# Altium project XTXBoard.PrjPCB
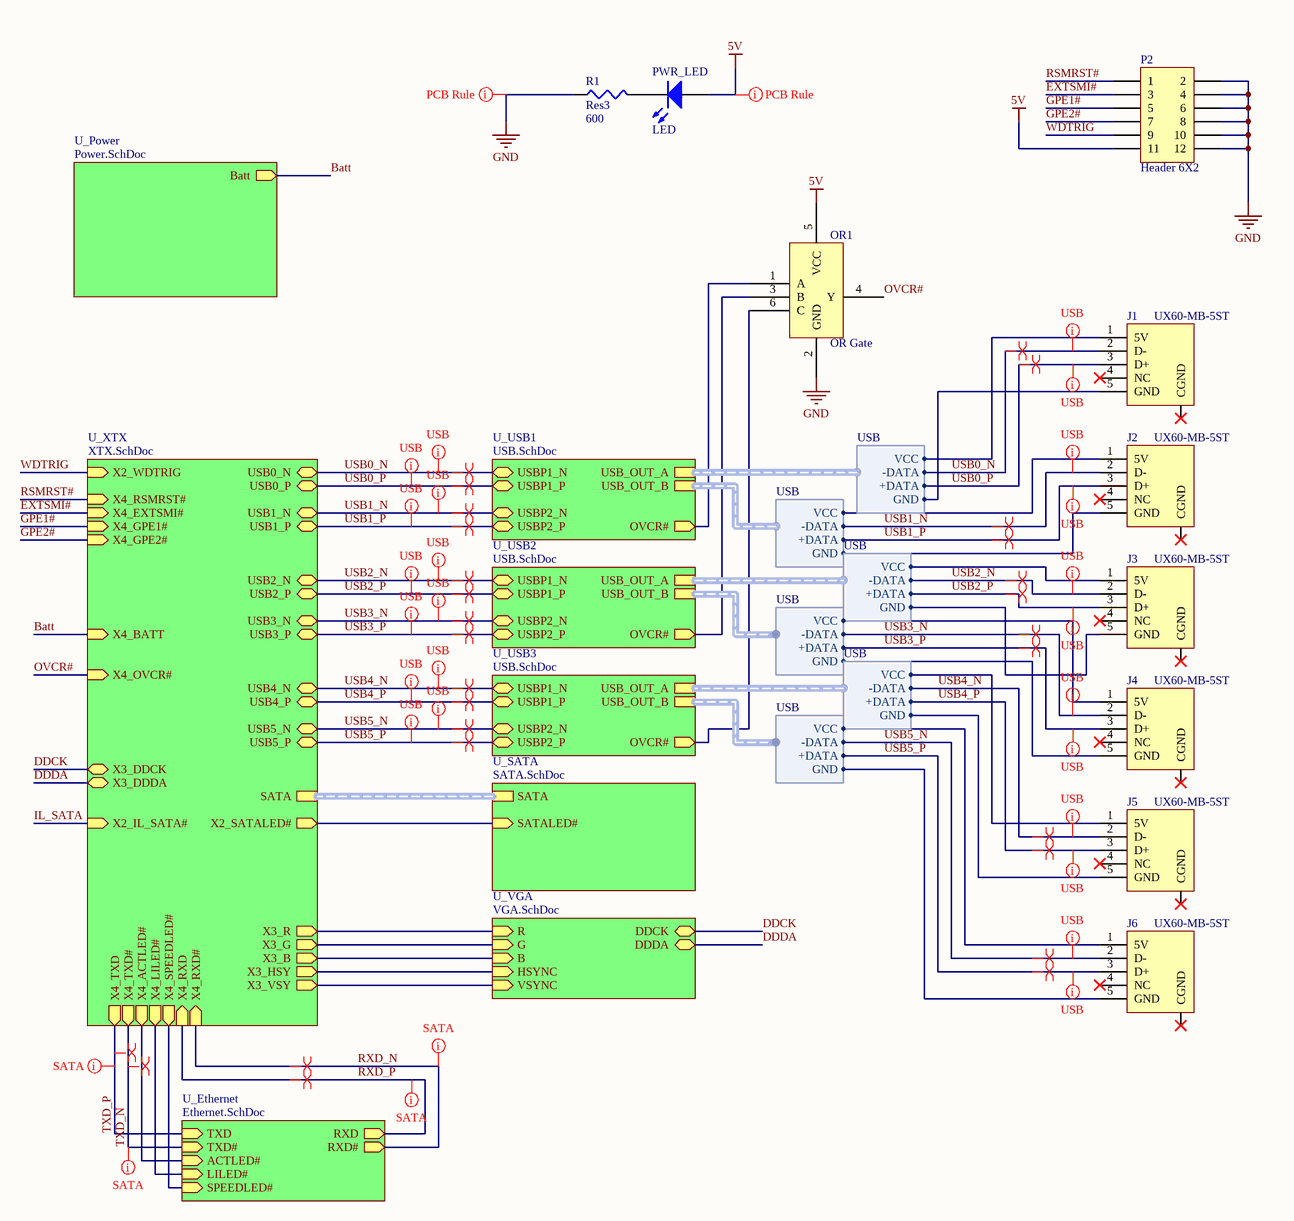
[diagram p0: Carrier_Board.SchDoc]
7 sheets, 110 parts. Net scope: hierarchical (ports join the sheet entries above them; power ports are global).
Board file: Carrier_Board.PcbDoc
Sheets:
  Carrier_Board.SchDoc
    U_USB1 = USB.SchDoc
    U_USB2 = USB.SchDoc
    U_USB3 = USB.SchDoc
    U_Ethernet = Ethernet.SchDoc
    U_SATA = SATA.SchDoc
    U_VGA = VGA.SchDoc
    U_XTX = XTX.SchDoc
    U_Power = Power.SchDoc

## Sheet Carrier_Board.SchDoc
size B

### Parts
J1  UX60-MB-5ST  [UX60-MB-5ST]
J2  UX60-MB-5ST  [UX60-MB-5ST]
J3  UX60-MB-5ST  [UX60-MB-5ST]
J4  UX60-MB-5ST  [UX60-MB-5ST]
J5  UX60-MB-5ST  [UX60-MB-5ST]
J6  UX60-MB-5ST  [UX60-MB-5ST]
OR1  OR Gate  [TSOP65P210X110-6N]
P2  Header 6X2  [HDR2X6]
PWR_LED  LED  [0805]
R1  Res3  value 600  [J1-0603]

### Sub-sheets
U_Ethernet = Ethernet.SchDoc: TXD (in), TXD# (in), RXD (out), RXD# (out), ACTLED# (in), LILED# (in), SPEEDLED# (in)
U_Power = Power.SchDoc: Batt (out)
U_SATA = SATA.SchDoc: SATA (harness SATA), SATALED# (in)
U_USB1 = USB.SchDoc: USB_OUT_A (harness USB), USB_OUT_B (harness USB), OVCR# (out), USBP1_N (bidir), USBP1_P (bidir), USBP2_N (bidir), USBP2_P (bidir)
U_USB2 = USB.SchDoc: USB_OUT_A (harness USB), USB_OUT_B (harness USB), OVCR# (out), USBP1_N (bidir), USBP1_P (bidir), USBP2_N (bidir), USBP2_P (bidir)
U_USB3 = USB.SchDoc: USB_OUT_A (harness USB), USB_OUT_B (harness USB), OVCR# (out), USBP1_N (bidir), USBP1_P (bidir), USBP2_N (bidir), USBP2_P (bidir)
U_VGA = VGA.SchDoc: R (in), G (in), B (in), HSYNC (in), VSYNC (in), DDCK (bidir), DDDA (bidir)
U_XTX = XTX.SchDoc: X4_OVCR# (in), SATA (harness SATA), X2_IL_SATA# (in), X2_SATALED# (out), X3_R (out), X3_HSY (out), X3_VSY (out), X3_DDCK (bidir), X3_DDDA (bidir), X4_BATT (in), X4_LILED# (out), X4_ACTLED# (out), X4_SPEEDLED# (out), X4_RXD# (in), X4_RXD (in), X4_TXD# (out), X4_TXD (out), X3_B (out), X3_G (out), X2_WDTRIG (in), X4_RSMRST# (in), X4_EXTSMI# (in), X4_GPE2# (in), X4_GPE1# (in), USB2_N (bidir), USB3_N (bidir), USB2_P (bidir), USB3_P (bidir), USB0_N (bidir), USB0_P (bidir), USB1_P (bidir), USB1_N (bidir), USB5_N (bidir), USB4_P (bidir), USB4_N (bidir), USB5_P (bidir)

### Harnesses
USB: VCC, -DATA, +DATA, GND

### Nets
5V: OR1.5(VCC) P2.11 PWR_LED.1(A)
GND: OR1.2(GND) P2.2 P2.4 P2.6 P2.8 P2.10 P2.12 R1.1
Batt: sheet U_XTX/X4_BATT, sheet U_Power/Batt
DDCK: sheet U_VGA/DDCK, sheet U_XTX/X3_DDCK
DDDA: sheet U_VGA/DDDA, sheet U_XTX/X3_DDDA
EXTSMI#: P2.3 ; sheet U_XTX/X4_EXTSMI#
GPE1#: P2.5 ; sheet U_XTX/X4_GPE1#
GPE2#: P2.7 ; sheet U_XTX/X4_GPE2#
OVCR#: OR1.4(Y) ; sheet U_XTX/X4_OVCR#
RSMRST#: P2.1 ; sheet U_XTX/X4_RSMRST#
RXD_N: sheet U_Ethernet/RXD#, sheet U_XTX/X4_RXD#
RXD_P: sheet U_Ethernet/RXD, sheet U_XTX/X4_RXD
TXD_N: sheet U_Ethernet/TXD#, sheet U_XTX/X4_TXD#
TXD_P: sheet U_Ethernet/TXD, sheet U_XTX/X4_TXD
USB0_N: J1.2(D-) ; sheet U_USB1/USBP1_N, sheet U_XTX/USB0_N, sheet U_USB1/USB_OUT_A.-DATA
USB0_P: J1.3(D+) ; sheet U_USB1/USBP1_P, sheet U_XTX/USB0_P, sheet U_USB1/USB_OUT_A.+DATA
USB1_N: J2.2(D-) ; sheet U_USB1/USBP2_N, sheet U_XTX/USB1_N, sheet U_USB1/USB_OUT_B.-DATA
USB1_P: J2.3(D+) ; sheet U_USB1/USBP2_P, sheet U_XTX/USB1_P, sheet U_USB1/USB_OUT_B.+DATA
USB2_N: J3.2(D-) ; sheet U_USB2/USBP1_N, sheet U_XTX/USB2_N, sheet U_USB2/USB_OUT_A.-DATA
USB2_P: J3.3(D+) ; sheet U_USB2/USBP1_P, sheet U_XTX/USB2_P, sheet U_USB2/USB_OUT_A.+DATA
USB3_N: J4.2(D-) ; sheet U_USB2/USBP2_N, sheet U_XTX/USB3_N, sheet U_USB2/USB_OUT_B.-DATA
USB3_P: J4.3(D+) ; sheet U_USB2/USBP2_P, sheet U_XTX/USB3_P, sheet U_USB2/USB_OUT_B.+DATA
USB4_N: J5.2(D-) ; sheet U_USB3/USBP1_N, sheet U_XTX/USB4_N, sheet U_USB3/USB_OUT_A.-DATA
USB4_P: J5.3(D+) ; sheet U_USB3/USBP1_P, sheet U_XTX/USB4_P, sheet U_USB3/USB_OUT_A.+DATA
USB5_N: J6.2(D-) ; sheet U_USB3/USBP2_N, sheet U_XTX/USB5_N, sheet U_USB3/USB_OUT_B.-DATA
USB5_P: J6.3(D+) ; sheet U_USB3/USBP2_P, sheet U_XTX/USB5_P, sheet U_USB3/USB_OUT_B.+DATA
WDTRIG: P2.9 ; sheet U_XTX/X2_WDTRIG
NetC8_1_2: J1.1(5V) ; sheet U_USB1/USB_OUT_A.VCC
NetC8_2_2: J3.1(5V) ; sheet U_USB2/USB_OUT_A.VCC
NetC8_3_2: J5.1(5V) ; sheet U_USB3/USB_OUT_A.VCC
NetC9_1_2: J1.5(GND) ; sheet U_USB1/USB_OUT_A.GND
NetC9_2_2: J3.5(GND) ; sheet U_USB2/USB_OUT_A.GND
NetC9_3_2: J5.5(GND) ; sheet U_USB3/USB_OUT_A.GND
NetC10_1_2: J2.1(5V) ; sheet U_USB1/USB_OUT_B.VCC
NetC10_2_2: J4.1(5V) ; sheet U_USB2/USB_OUT_B.VCC
NetC10_3_2: J6.1(5V) ; sheet U_USB3/USB_OUT_B.VCC
NetC11_1_2: J2.5(GND) ; sheet U_USB1/USB_OUT_B.GND
NetC11_2_2: J4.5(GND) ; sheet U_USB2/USB_OUT_B.GND
NetC11_3_2: J6.5(GND) ; sheet U_USB3/USB_OUT_B.GND
NetC12_1: sheet U_VGA/B, sheet U_XTX/X3_B
NetC13_1: sheet U_VGA/G, sheet U_XTX/X3_G
NetC14_1: sheet U_VGA/R, sheet U_XTX/X3_R
NetD2_2: sheet U_Ethernet/SPEEDLED#, sheet U_XTX/X4_SPEEDLED#
NetIC1_1_2: OR1.1(A) ; sheet U_USB1/OVCR#
NetIC1_2_2: OR1.3(B) ; sheet U_USB2/OVCR#
NetIC1_3_2: OR1.6(C) ; sheet U_USB3/OVCR#
NetPWR_LED_2: PWR_LED.2(K) R1.2
NetR6_1: sheet U_SATA/SATALED#, sheet U_XTX/X2_SATALED#
NetU1_13: sheet U_VGA/HSYNC, sheet U_XTX/X3_HSY
NetU1_15: sheet U_VGA/VSYNC, sheet U_XTX/X3_VSY
NetX1_10: sheet U_Ethernet/LILED#, sheet U_XTX/X4_LILED#
NetX1_12: sheet U_Ethernet/ACTLED#, sheet U_XTX/X4_ACTLED#

Not connected (* = marked no-connect by the designer): J1 4(NC)* CGND*; J2 4(NC)* CGND*; J3 4(NC)* CGND*; J4 4(NC)* CGND*; J5 4(NC)* CGND*; J6 4(NC)* CGND*

### Buses and harness runs
harness sheet U_SATA/SATA = sheet U_XTX/SATA

### Layout directives
differential pair: RXD_N, RXD_P, TXD_N, TXD_P, USB0_N, USB0_P, USB1_N, USB1_P, USB2_N, USB2_P, USB3_N, USB3_P, USB4_N, USB4_P, USB5_N, USB5_P
rule Length Constraint [Min Length = 0mil    Max Length = 15000mil]; rule Impedance Constraint [Min = 0.000    Max = 105.0    ]; rule Width Constraint [Pref Width = 7mil    Min Width = 7mil    Max Width = 7mil]; rule Differential Pairs Routing [Pref Gap = 5mil    Min Gap  = 5mil    Max Gap  = 10mil]; rule Maximum Via Count Constraint [Max Count = 4]: USB0_N, USB0_P, USB1_N, USB1_P, USB2_N, USB2_P, USB3_N, USB3_P, USB4_N, USB4_P, USB5_N, USB5_P
rule Length Constraint [Min Length = 0mil    Max Length = 4000mil]; rule Width Constraint [Pref Width = 5mil    Min Width = 5mil    Max Width = 6mil]; rule Differential Pairs Routing [Pref Gap = 4mil    Min Gap  = 4mil    Max Gap  = 7mil]; rule Maximum Via Count Constraint [Max Count = 4]; rule Matched Net Lengths [Tolerance = 5mil]: RXD_N, RXD_P, TXD_N, TXD_P
rule Width Constraint [Pref Width = 10mil    Min Width = 7mil    Max Width = 100mil]: 5V, GND

### Library data of the parts
J1-J6 = UX60-MB-5ST: miniUSB Type B SMT Connector; Supplier Part #: H2959CT-ND; Supplier: Digi-Key
OR1 = OR Gate: 3 Input OR Gate; Supplier: DigiKey; Supplier Part #: 296-15943-1-ND
P2 = Header 6X2: Header, 6-Pin, Dual row; LatestRevisionDate: 17-Jul-2002; LatestRevisionNote: Re-released for DXP Platform.; Publisher: Altium Limited; Supplier: DigiKey; Supplier Part #: WM8124-ND
PWR_LED = LED1: Typical RED GaAs LED; Published: 8-Jun-2000; LatestRevisionDate: 08-Jul-2005; LatestRevisionNote: Mech Layer 1 removed.; PackageReference: LED-1; Publisher: Altium Limited; Supplier Part #: 475-2483-6-ND; Supplier: DigiKey
R1 = Res3: Resistor; Published: 8-Jun-2000; LatestRevisionDate: 04-Mar-2005; LatestRevisionNote: PCB Footprint replaced.; PackageReference: J1-0603; Publisher: Altium Limited; Supplier Part #: P604HCT-ND; Supplier: DigiKey

## Sheet USB.SchDoc
size A
Used 3 times, as channels U_USB1, U_USB2, U_USB3. Parts and nets are listed once, with the designators drawn on the sheet.
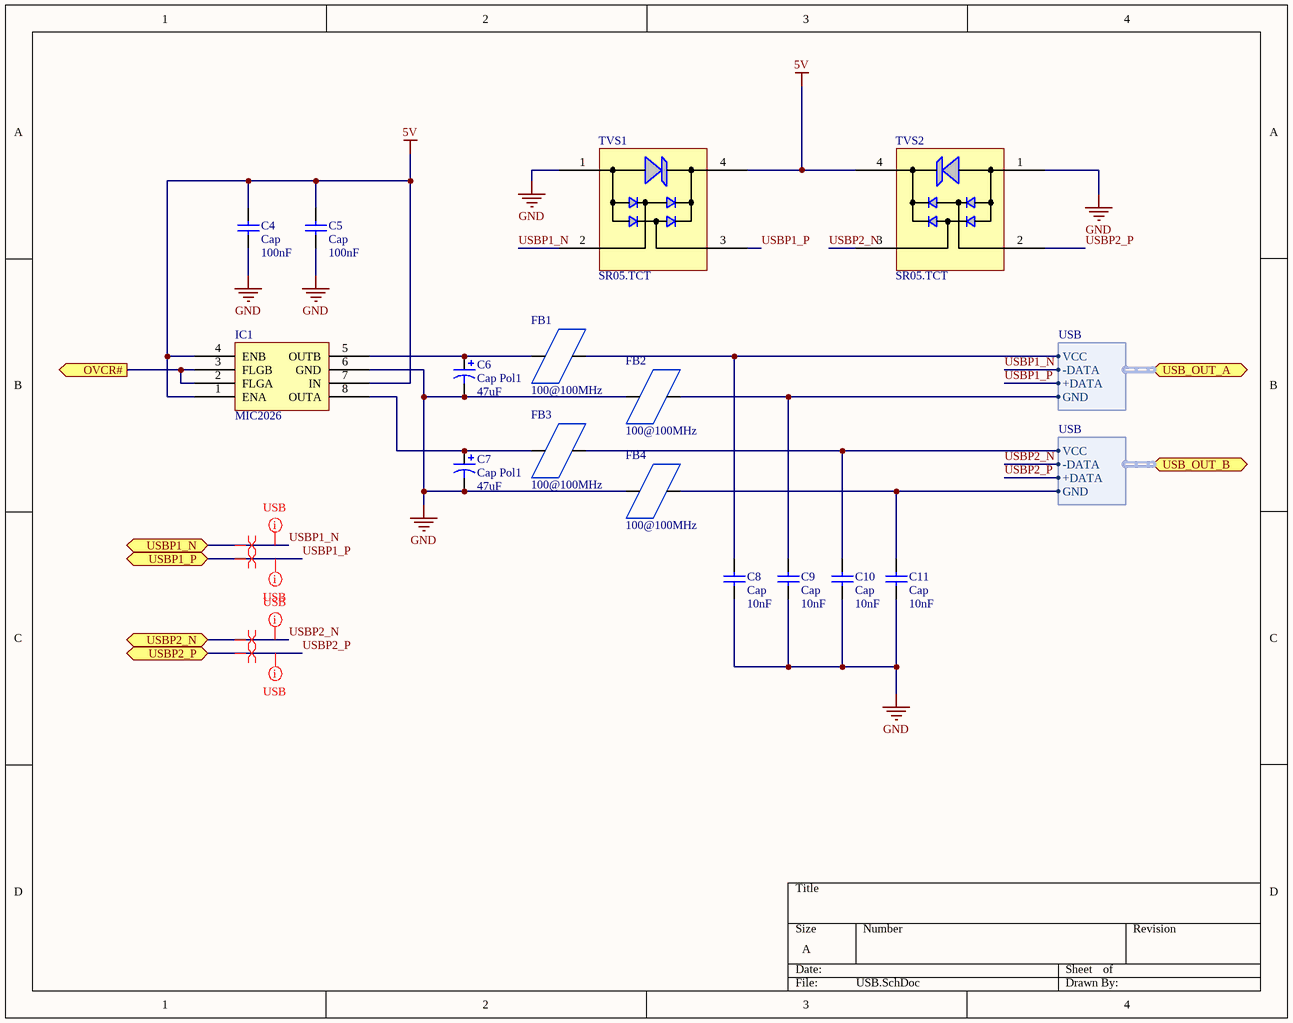
[diagram p1: USB.SchDoc]

### Parts
C4  Cap  value 100nF  [0603]
C5  Cap  value 100nF  [0603]
C6  Cap Pol1  value 47uF  [CAPPR5-5x5]
C7  Cap Pol1  value 47uF  [CAPPR5-5x5]
C8  Cap  value 10nF  [0603]
C9  Cap  value 10nF  [0603]
C10  Cap  value 10nF  [0603]
C11  Cap  value 10nF  [0603]
FB1  100@100MHz  [INDC1608X09N]
FB2  100@100MHz  [INDC1608X09N]
FB3  100@100MHz  [INDC1608X09N]
FB4  100@100MHz  [INDC1608X09N]
IC1  MIC2026  [8-Pin SOIC]
TVS1  SR05.TCT  [SOT143]
TVS2  SR05.TCT  [SOT143]

### Ports
OVCR# (out), USB_OUT_A (harness USB), USB_OUT_B (harness USB), USBP1_N (bidir), USBP1_P (bidir), USBP2_N (bidir), USBP2_P (bidir)

### Harnesses
USB: VCC, -DATA, +DATA, GND

### Nets
5V: C4.2 C5.2 IC1.1(ENA) IC1.4(ENB) IC1.7(IN) TVS1.4 TVS2.4
GND: C4.1 C5.1 C6.2 C7.2 C8.1 C9.1 C10.1 C11.1 FB2.1 FB4.1 IC1.6(GND) TVS1.1 TVS2.1
OVCR#: IC1.2(FLGA) IC1.3(FLGB) ; port OVCR#
USBP1_N: TVS1.2 ; port USBP1_N, port USB_OUT_A.-DATA
USBP1_P: TVS1.3 ; port USBP1_P, port USB_OUT_A.+DATA
USBP2_N: TVS2.3 ; port USBP2_N, port USB_OUT_B.-DATA
USBP2_P: TVS2.2 ; port USBP2_P, port USB_OUT_B.+DATA
NetC6_1: C6.1 FB1.1 IC1.5(OUTB)
NetC7_1: C7.1 FB3.1 IC1.8(OUTA)
NetC8_2: C8.2 FB1.2 ; port USB_OUT_A.VCC
NetC9_2: C9.2 FB2.2 ; port USB_OUT_A.GND
NetC10_2: C10.2 FB3.2 ; port USB_OUT_B.VCC
NetC11_2: C11.2 FB4.2 ; port USB_OUT_B.GND

### Channels
U_USB1: designators end in _1; ports OVCR#=NetIC1_1_2 USBP1_N=USB0_N USBP1_P=USB0_P USBP2_N=USB1_N USBP2_P=USB1_P
U_USB2: designators end in _2; ports OVCR#=NetIC1_2_2 USBP1_N=USB2_N USBP1_P=USB2_P USBP2_N=USB3_N USBP2_P=USB3_P
U_USB3: designators end in _3; ports OVCR#=NetIC1_3_2 USBP1_N=USB4_N USBP1_P=USB4_P USBP2_N=USB5_N USBP2_P=USB5_P

### Layout directives
differential pair: USB0_N, USB0_P, USB1_N, USB1_P
rule Length Constraint [Min Length = 0mil    Max Length = 15000mil]; rule Impedance Constraint [Min = 0.000    Max = 105.0    ]; rule Width Constraint [Pref Width = 7mil    Min Width = 7mil    Max Width = 7mil]; rule Differential Pairs Routing [Pref Gap = 5mil    Min Gap  = 5mil    Max Gap  = 10mil]; rule Maximum Via Count Constraint [Max Count = 4]: USB0_N, USB0_P, USB1_N, USB1_P

### Library data of the parts
C4 C5 C8-C11 = Cap: Capacitor; Published: 8-Jun-2000; LatestRevisionDate: 17-Jul-2002; LatestRevisionNote: Re-released for DXP Platform.; PackageReference: RAD-0.3; Publisher: Altium Limited; Supplier: DigiKey
  C4 C5: Supplier Part #: 587-1245-1-ND
  C8-C11: Supplier Part #: 490-1512-1-ND
C6 C7 = Cap Pol1: Polarized Capacitor (Radial); Published: 8-Jun-2000; LatestRevisionDate: 17-Jul-2002; LatestRevisionNote: Re-released for DXP Platform.; PackageReference: RB7.6-15; Publisher: Altium Limited; Supplier Part #: P5137-ND; Supplier: DigiKey
FB1-FB4 = Ferrite Bead: Supplier Part #: 587-1922-1-ND; Supplier: DigiKey
IC1 = MIC2026: Micrel MIC2026 Dual-Channel Power Distribution Switch; Model: MIC2026; Supplier Part #: 576-1059-1-ND; Supplier: DigiKey
TVS1 TVS2 = SR05.TCT: IC TVS ARRAY 2-LINE 5V SOT-143; Model: SR05; Supplier Part #: SR05CT-ND; Supplier: DigiKey

## Sheet Ethernet.SchDoc
size A
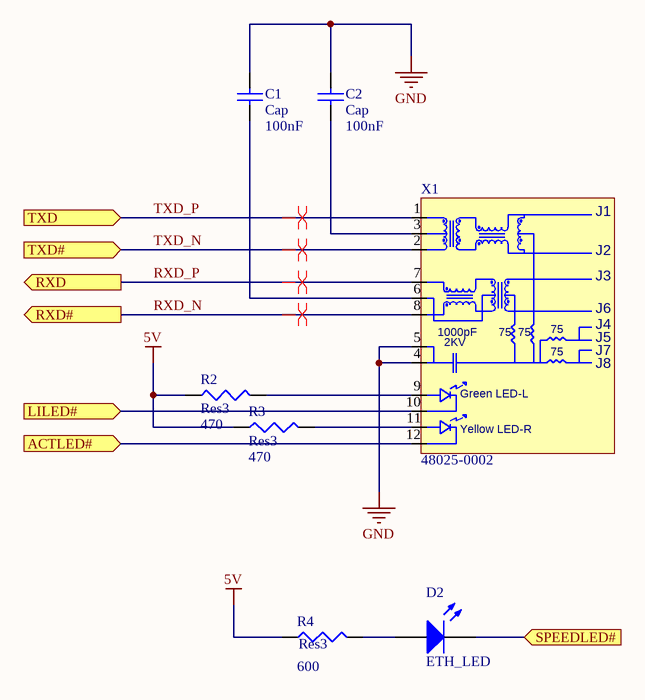
[diagram p2: Ethernet.SchDoc]

### Parts
C1  Cap  value 100nF  [0603]
C2  Cap  value 100nF  [0603]
D2  ETH_LED  [0805]
R2  Res3  value 470  [J1-0603]
R3  Res3  value 470  [J1-0603]
R4  Res3  value 600  [J1-0603]
X1  48025-0002  [48025-0002]

### Ports
ACTLED# (in), LILED# (in), RXD (out), RXD# (out), SPEEDLED# (in), TXD (in), TXD# (in)

### Nets
5V: R2.1 R3.1 R4.1
GND: C1.2 C2.2 X1.4 X1.5
RXD_N: X1.8 ; port RXD#
RXD_P: X1.7 ; port RXD
TXD_N: X1.2 ; port TXD#
TXD_P: X1.1 ; port TXD
NetC1_1: C1.1 X1.6
NetC2_1: C2.1 X1.3
NetD2_1: D2.1(A) R4.2
NetD2_2: D2.2(K) ; port SPEEDLED#
NetR2_2: R2.2 X1.9
NetR3_2: R3.2 X1.11
NetX1_10: X1.10 ; port LILED#
NetX1_12: X1.12 ; port ACTLED#

### Layout directives
differential pair: RXD_N, RXD_P, TXD_N, TXD_P

### Notes on the sheet
- (in symbol 48025-0002) J1; J2; J3; J6; J4; 1000pF; 75; 2KV; J5; J7; J8; Green LED-L; Yellow LED-R

### Library data of the parts
C1 C2 = Cap: Capacitor; Published: 8-Jun-2000; LatestRevisionDate: 17-Jul-2002; LatestRevisionNote: Re-released for DXP Platform.; PackageReference: RAD-0.3; Publisher: Altium Limited; Supplier Part #: 587-1245-1-ND; Supplier: DigiKey
D2 = LED1: Typical RED GaAs LED; Published: 8-Jun-2000; LatestRevisionDate: 08-Jul-2005; LatestRevisionNote: Mech Layer 1 removed.; PackageReference: LED-1; Publisher: Altium Limited; Supplier Part #: 475-2483-6-ND; Supplier: DigiKey
R2-R4 = Res3: Resistor; Published: 8-Jun-2000; LatestRevisionDate: 04-Mar-2005; LatestRevisionNote: PCB Footprint replaced.; PackageReference: J1-0603; Publisher: Altium Limited; Supplier: DigiKey
  R2 R3: Supplier Part #: P470HTR-ND
  R4: Supplier Part #: P604HCT-ND
X1 = 48025-0002: Modular RJ45 Jack w/ Magnetics & LEDs; Model: 48025-0002; Supplier Part #: WM5449-ND; Supplier: DigiKey

## Sheet SATA.SchDoc
size A
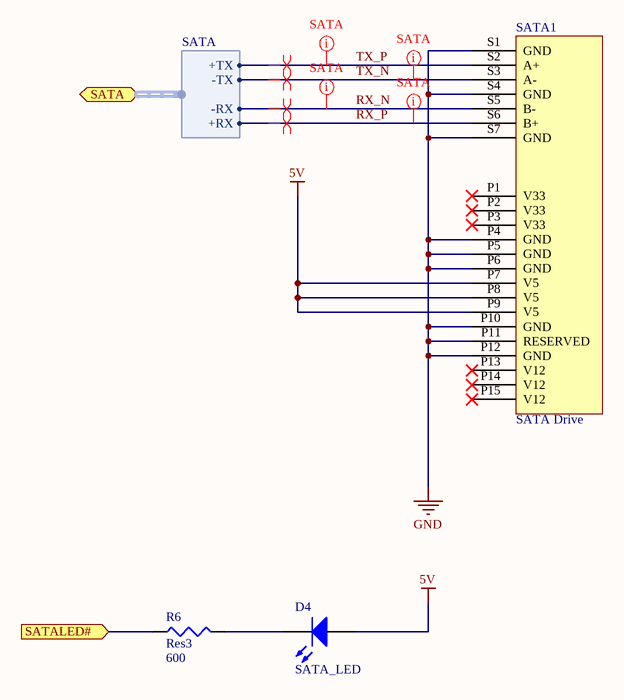
[diagram p3: SATA.SchDoc]

### Parts
D4  SATA_LED  [0805]
R6  Res3  value 600  [J1-0603]
SATA1  SATA Drive  [SATA COMB RECEPTICLE]

### Ports
SATA (harness SATA), SATALED# (in)

### Harnesses
SATA: +TX, -TX, -RX, +RX

### Nets
5V: D4.1(A) SATA1.P7(V5) SATA1.P8(V5) SATA1.P9(V5)
GND: SATA1.P4(GND) SATA1.P5(GND) SATA1.P6(GND) SATA1.P10(GND) SATA1.P11(RESERVED) SATA1.P12(GND) SATA1.S1(GND) SATA1.S4(GND) SATA1.S7(GND)
RX_N: SATA1.S5(B-) ; port SATA.-RX
RX_P: SATA1.S6(B+) ; port SATA.+RX
TX_N: SATA1.S3(A-) ; port SATA.-TX
TX_P: SATA1.S2(A+) ; port SATA.+TX
NetD4_2: D4.2(K) R6.2
NetR6_1: R6.1 ; port SATALED#

Not connected (* = marked no-connect by the designer): SATA1 P1(V33)* P2(V33)* P3(V33)* P13(V12)* P14(V12)* P15(V12)*

### Layout directives
differential pair: RX_N, RX_P, TX_N, TX_P
rule Length Constraint [Min Length = 0mil    Max Length = 4000mil]; rule Width Constraint [Pref Width = 5mil    Min Width = 5mil    Max Width = 6mil]; rule Differential Pairs Routing [Pref Gap = 4mil    Min Gap  = 4mil    Max Gap  = 7mil]; rule Maximum Via Count Constraint [Max Count = 4]; rule Matched Net Lengths [Tolerance = 5mil]: RX_N, RX_P, TX_N, TX_P

### Library data of the parts
D4 = LED1: Typical RED GaAs LED; Published: 8-Jun-2000; LatestRevisionDate: 08-Jul-2005; LatestRevisionNote: Mech Layer 1 removed.; PackageReference: LED-1; Publisher: Altium Limited; Supplier Part #: 475-2483-6-ND; Supplier: DigiKey
R6 = Res3: Resistor; Published: 8-Jun-2000; LatestRevisionDate: 04-Mar-2005; LatestRevisionNote: PCB Footprint replaced.; PackageReference: J1-0603; Publisher: Altium Limited; Supplier Part #: P604HCT-ND; Supplier: DigiKey
SATA1 = SATA Drive: SATA HDD, FCI Part# 10029364; Model: 10029364; Supplier: DigiKey; Supplier Part #: 609-1028-ND

## Sheet VGA.SchDoc
size A
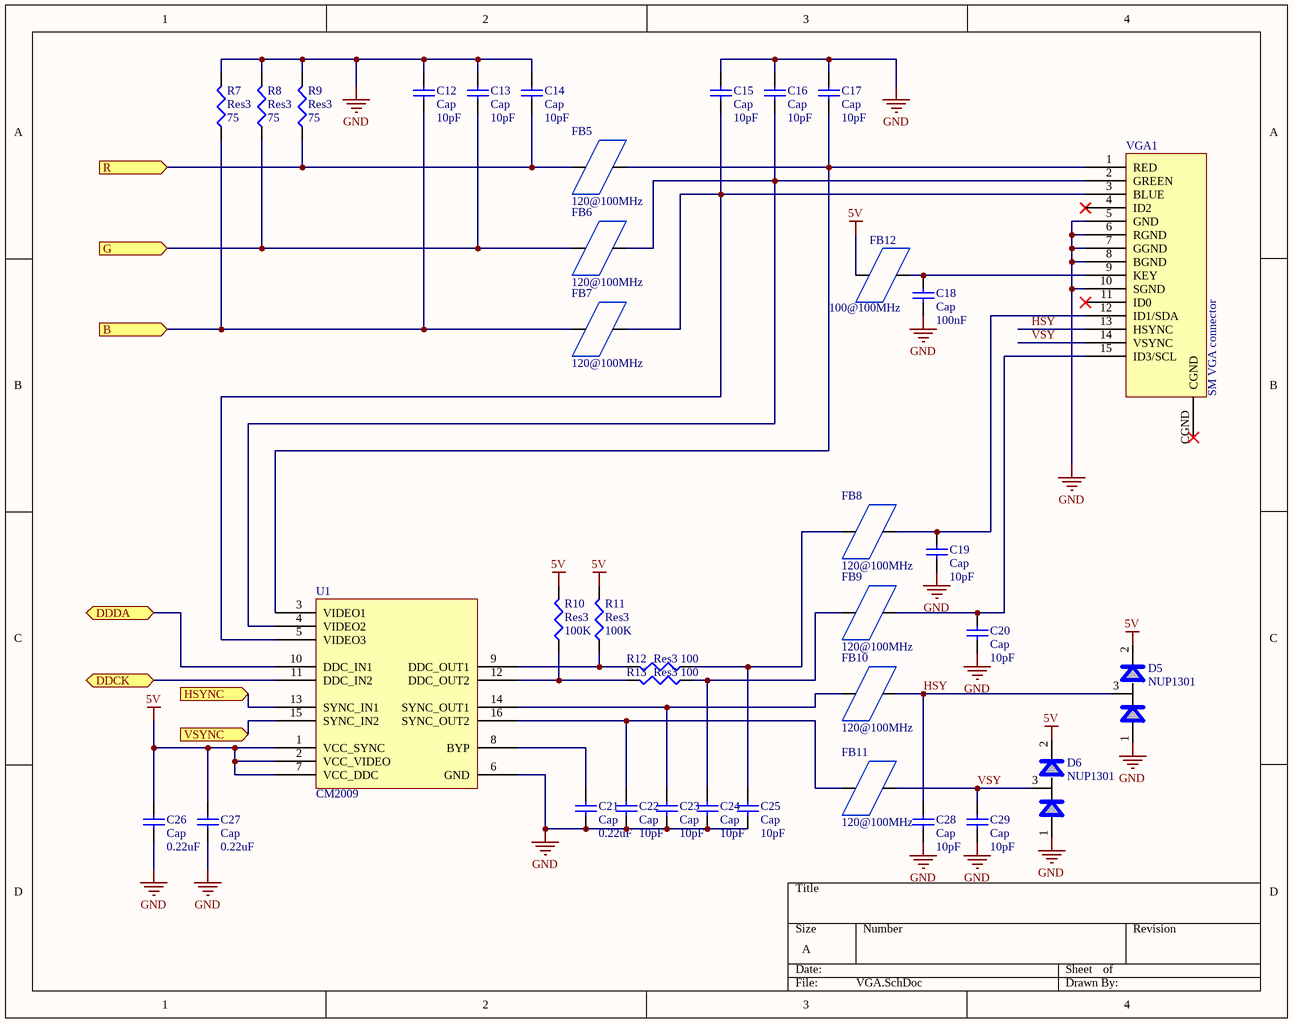
[diagram p4: VGA.SchDoc]

### Parts
C12  Cap  value 10pF  [0603]
C13  Cap  value 10pF  [0603]
C14  Cap  value 10pF  [0603]
C15  Cap  value 10pF  [0603]
C16  Cap  value 10pF  [0603]
C17  Cap  value 10pF  [0603]
C18  Cap  value 100nF  [0603]
C19  Cap  value 10pF  [0603]
C20  Cap  value 10pF  [0603]
C21  Cap  value 0.22uF  [0603]
C22  Cap  value 10pF  [0603]
C23  Cap  value 10pF  [0603]
C24  Cap  value 10pF  [0603]
C25  Cap  value 10pF  [0603]
C26  Cap  value 0.22uF  [0603]
C27  Cap  value 0.22uF  [0603]
C28  Cap  value 10pF  [0603]
C29  Cap  value 10pF  [0603]
D5  NUP1301  [SOT23]
D6  NUP1301  [SOT23]
FB5  120@100MHz  [INDC1608X09N]
FB6  120@100MHz  [INDC1608X09N]
FB7  120@100MHz  [INDC1608X09N]
FB8  120@100MHz  [INDC1608X09N]
FB9  120@100MHz  [INDC1608X09N]
FB10  120@100MHz  [INDC1608X09N]
FB11  120@100MHz  [INDC1608X09N]
FB12  100@100MHz  [INDC1608X09N]
R7  Res3  value 75  [J1-0603]
R8  Res3  value 75  [J1-0603]
R9  Res3  value 75  [J1-0603]
R10  Res3  value 100K  [J1-0603]
R11  Res3  value 100K  [J1-0603]
R12  Res3  value 100  [J1-0603]
R13  Res3  value 100  [J1-0603]
U1  CM2009  [SOP64P630X173-16N]
VGA1  SM VGA connector  [15POS SM 30MIL-PITCH]

### Ports
B (in), DDCK (bidir), DDDA (bidir), G (in), HSYNC (in), R (in), VSYNC (in)

### Nets
5V: C26.2 C27.2 D5.2 D6.2 FB12.1 R10.2 R11.2 U1.1(VCC_SYNC) U1.2(VCC_VIDEO) U1.7(VCC_DDC)
GND: C12.2 C13.2 C14.2 C15.2 C16.2 C17.2 C18.1 C19.1 C20.1 C21.1 C22.1 C23.1 C24.1 C25.1 C26.1 C27.1 C28.1 C29.1 D5.1 D6.1 R7.2 R8.2 R9.2 U1.6(GND) VGA1.5(GND) VGA1.6(RGND) VGA1.7(GGND) VGA1.8(BGND) VGA1.10(SGND)
DDCK: U1.11(DDC_IN2) ; port DDCK
DDDA: U1.10(DDC_IN1) ; port DDDA
HSY: C28.2 D5.3 FB10.2 VGA1.13(HSYNC)
VSY: C29.2 D6.3 FB11.2 VGA1.14(VSYNC)
NetC12_1: C12.1 FB7.1 R7.1 ; port B
NetC13_1: C13.1 FB6.1 R8.1 ; port G
NetC14_1: C14.1 FB5.1 R9.1 ; port R
NetC15_1: C15.1 FB7.2 U1.5(VIDEO3) VGA1.3(BLUE)
NetC16_1: C16.1 FB6.2 U1.4(VIDEO2) VGA1.2(GREEN)
NetC17_1: C17.1 FB5.2 U1.3(VIDEO1) VGA1.1(RED)
NetC18_2: C18.2 FB12.2 VGA1.9(KEY)
NetC19_2: C19.2 FB8.2 VGA1.12(ID1/SDA)
NetC20_2: C20.2 FB9.2 VGA1.15(ID3/SCL)
NetC21_2: C21.2 U1.8(BYP)
NetC22_2: C22.2 FB11.1 U1.16(SYNC_OUT2)
NetC23_2: C23.2 FB10.1 U1.14(SYNC_OUT1)
NetC24_2: C24.2 FB9.1 R13.1
NetC25_2: C25.2 FB8.1 R12.1
NetR10_1: R10.1 R13.2 U1.12(DDC_OUT2)
NetR11_1: R11.1 R12.2 U1.9(DDC_OUT1)
NetU1_13: U1.13(SYNC_IN1) ; port HSYNC
NetU1_15: U1.15(SYNC_IN2) ; port VSYNC

Not connected (* = marked no-connect by the designer): VGA1 4(ID2)* 11(ID0)* CGND*

### Library data of the parts
C12-C29 = Cap: Capacitor; Published: 8-Jun-2000; LatestRevisionDate: 17-Jul-2002; LatestRevisionNote: Re-released for DXP Platform.; PackageReference: RAD-0.3; Publisher: Altium Limited; Supplier: DigiKey
  C12-C17 C19 C20 C22-C25 C28 C29: Supplier Part #: PCC100CVCT-ND
  C18: Supplier Part #: 587-1245-1-ND
  C21 C26 C27: Supplier Part #: 587-1260-1-ND
D5 D6 = NUP1301: Low Capacitance Diode Array for ESD Protection; Model: NUP1301ML3T1; Supplier Part #: NUP1301ML3T1GOSCT-ND; Supplier: DigiKey
FB5-FB12 = Ferrite Bead: Supplier: DigiKey
  FB5-FB11: Supplier Part #: 445-2190-1-ND
  FB12: Supplier Part #: 587-1922-1-ND
R7-R13 = Res3: Resistor; Published: 8-Jun-2000; LatestRevisionDate: 04-Mar-2005; LatestRevisionNote: PCB Footprint replaced.; PackageReference: J1-0603; Publisher: Altium Limited; Supplier: DigiKey
  R7-R9: Supplier Part #: P75GCT-ND
  R10 R11: Supplier Part #: P100KGCT-ND
  R12 R13: Supplier Part #: P100GCT-ND
U1 = CM2009: VGA ESD Protection; Model: CM2009; Supplier Part #: 748-CM2009-00QR; Supplier: Mouser
VGA1 = VGA: Supplier Part #: 200-15FA-ND; Supplier: DigiKey

## Sheet XTX.SchDoc
size C
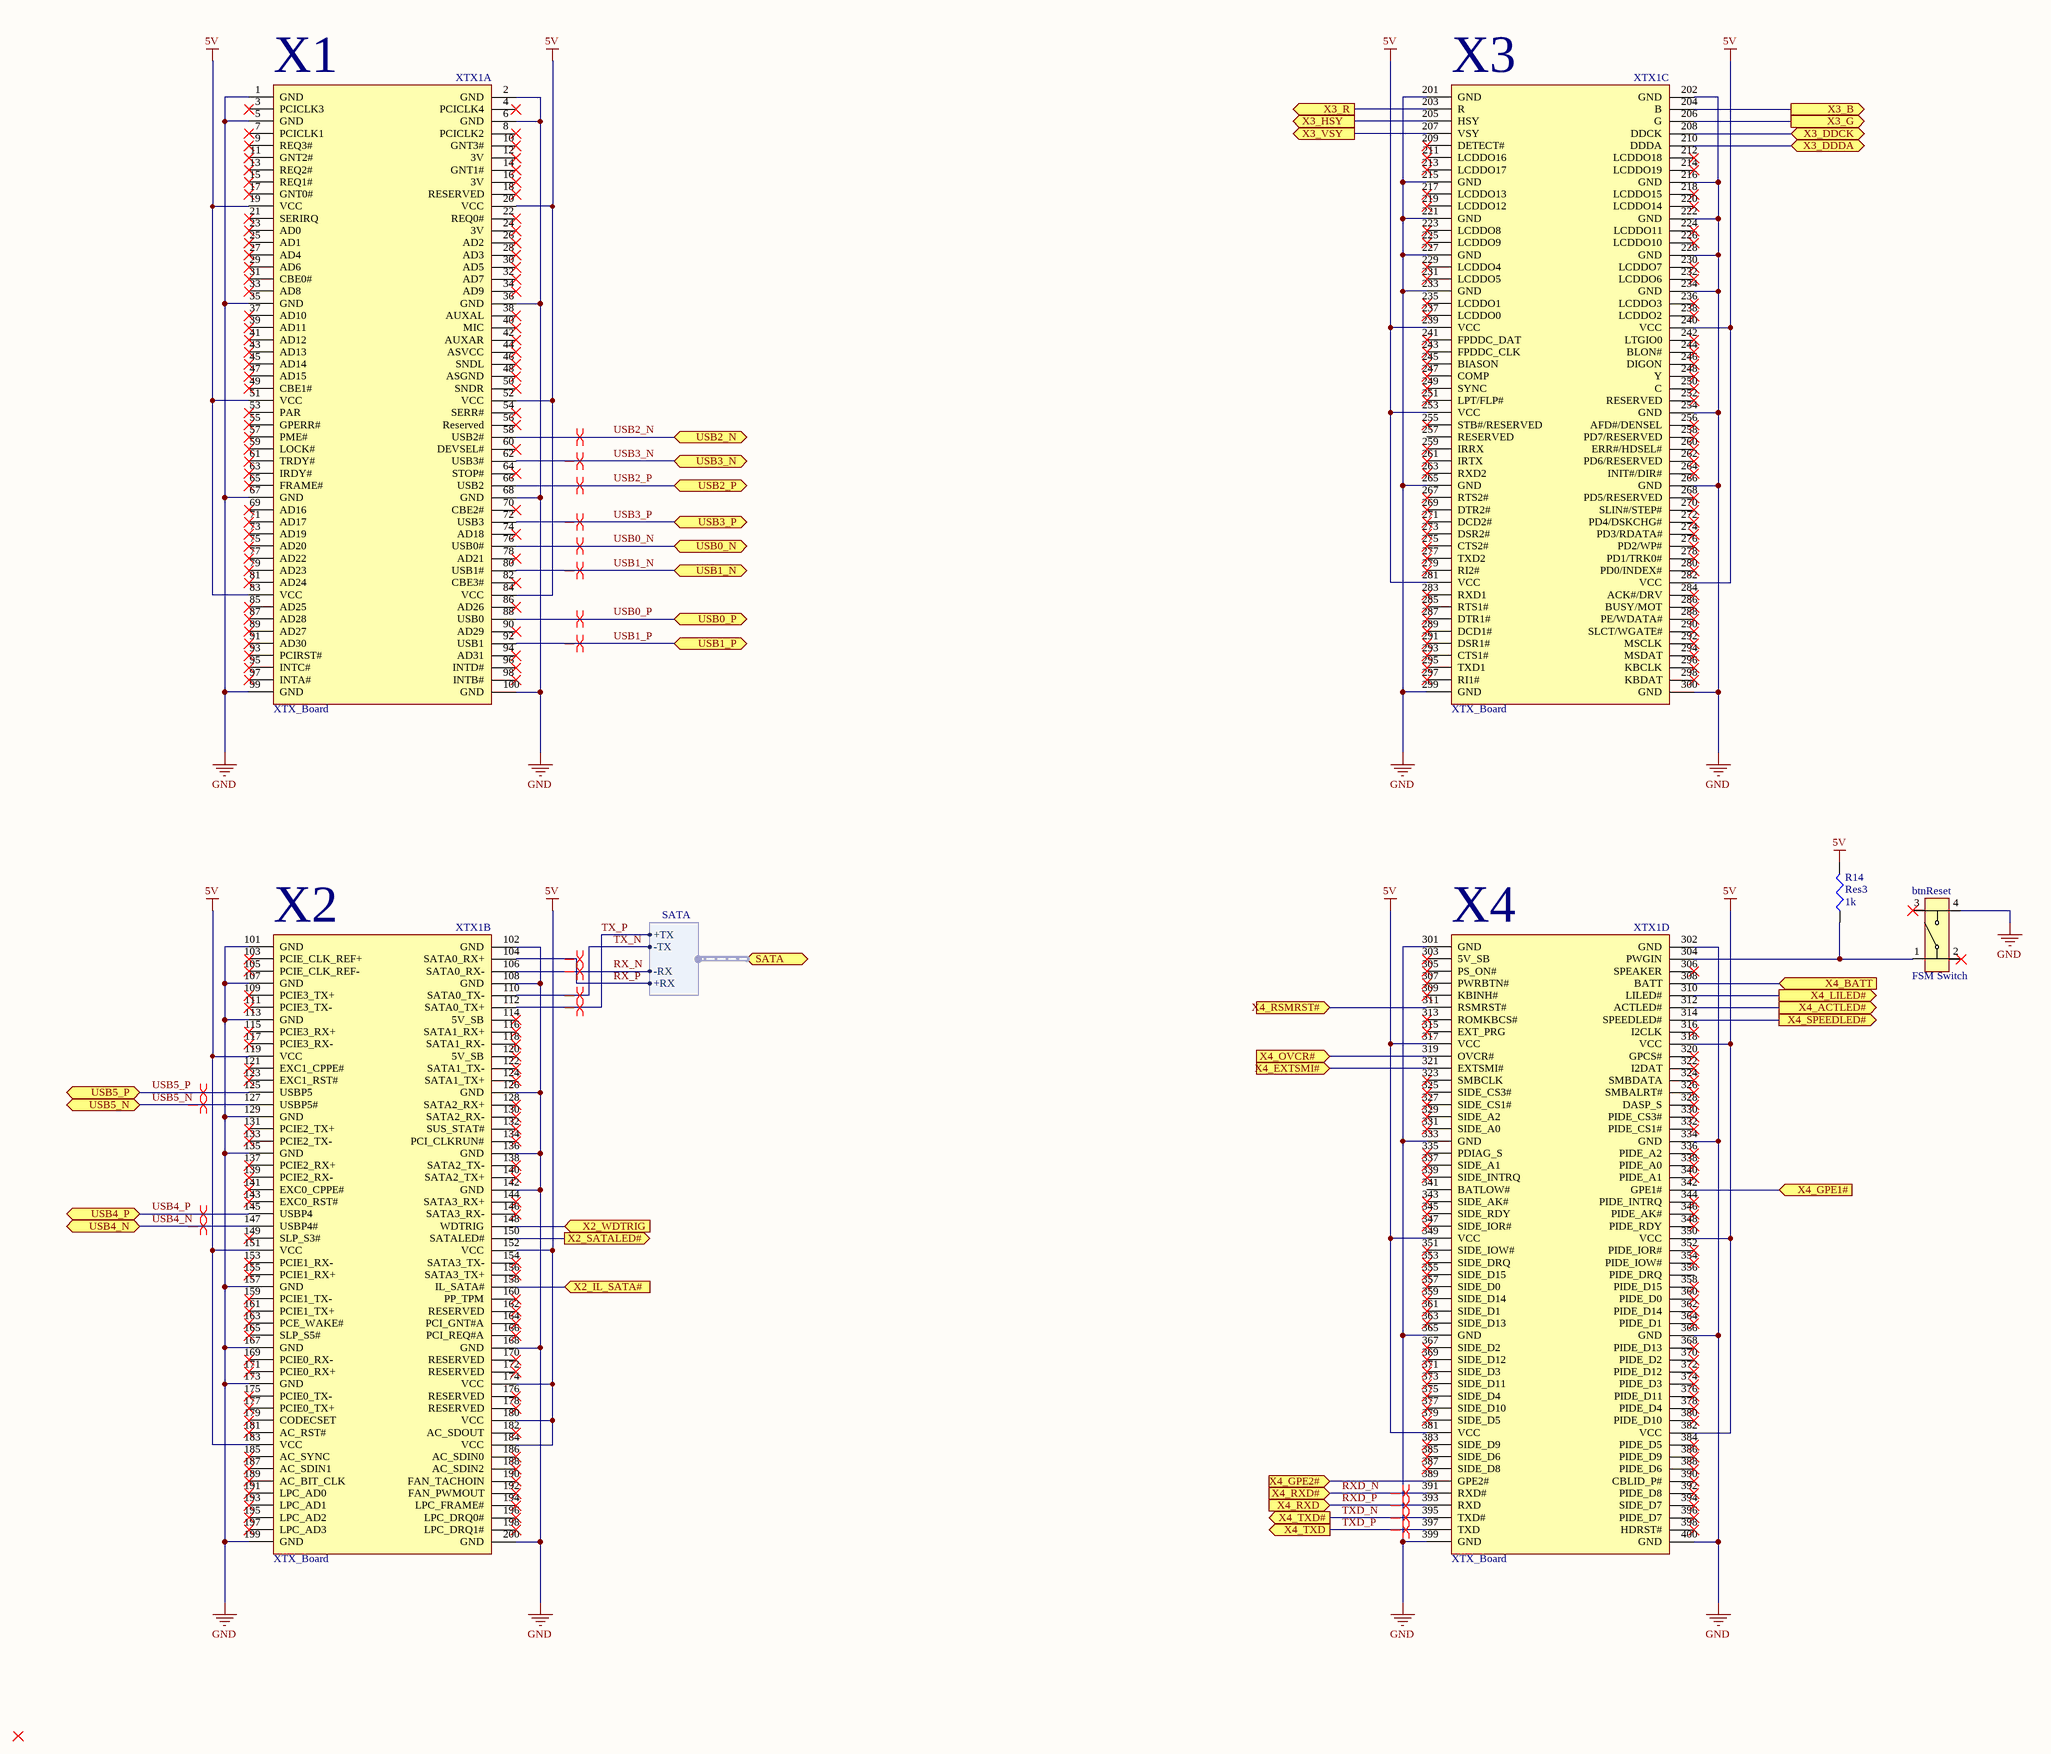
[diagram p5: XTX.SchDoc]

### Parts
btnReset  FSM Switch  [FSM4JH]
R14  Res3  value 1k  [J1-0603]
XTX1  XTX_Board  [XTX_Board]  (parts A,B,C,D of 4)

### Ports
SATA (harness SATA), USB0_N (bidir), USB0_P (bidir), USB1_N (bidir), USB1_P (bidir), USB2_N (bidir), USB2_P (bidir), USB3_N (bidir), USB3_P (bidir), USB4_N (bidir), USB4_P (bidir), USB5_N (bidir), USB5_P (bidir), X2_IL_SATA# (in), X2_SATALED# (out), X2_WDTRIG (in), X3_B (out), X3_DDCK (bidir), X3_DDDA (bidir), X3_G (out), X3_HSY (out), X3_R (out), X3_VSY (out), X4_ACTLED# (out), X4_BATT (in), X4_EXTSMI# (in), X4_GPE1# (in), X4_GPE2# (in), X4_LILED# (out), X4_OVCR# (in), X4_RSMRST# (in), X4_RXD (in), X4_RXD# (in), X4_SPEEDLED# (out), X4_TXD (out), X4_TXD# (out)

### Harnesses
SATA: +TX, -TX, -RX, +RX

### Nets
5V: R14.2 XTX1.19(VCC) XTX1.20(VCC) XTX1.51(VCC) XTX1.52(VCC) XTX1.83(VCC) XTX1.84(VCC) XTX1.119(VCC) XTX1.151(VCC) XTX1.152(VCC) XTX1.174(VCC) XTX1.180(VCC) XTX1.183(VCC) XTX1.184(VCC) XTX1.239(VCC) XTX1.240(VCC) XTX1.253(VCC) XTX1.281(VCC) XTX1.282(VCC) XTX1.317(VCC) XTX1.318(VCC) XTX1.349(VCC) XTX1.350(VCC) XTX1.381(VCC) XTX1.382(VCC)
GND: btnReset.4 XTX1.1(GND) XTX1.2(GND) XTX1.5(GND) XTX1.6(GND) XTX1.35(GND) XTX1.36(GND) XTX1.67(GND) XTX1.68(GND) XTX1.99(GND) XTX1.100(GND) XTX1.101(GND) XTX1.102(GND) XTX1.107(GND) XTX1.108(GND) XTX1.113(GND) XTX1.126(GND) XTX1.129(GND) XTX1.135(GND) XTX1.136(GND) XTX1.142(GND) XTX1.157(GND) XTX1.167(GND) XTX1.168(GND) XTX1.173(GND) XTX1.199(GND) XTX1.200(GND) XTX1.201(GND) XTX1.202(GND) XTX1.215(GND) XTX1.216(GND) XTX1.221(GND) XTX1.222(GND) XTX1.227(GND) XTX1.228(GND) XTX1.233(GND) XTX1.234(GND) XTX1.254(GND) XTX1.265(GND) XTX1.266(GND) XTX1.299(GND) XTX1.300(GND) XTX1.301(GND) XTX1.302(GND) XTX1.333(GND) XTX1.334(GND) XTX1.365(GND) XTX1.366(GND) XTX1.399(GND) XTX1.400(GND)
Batt: XTX1.308(BATT) ; port X4_BATT
DDCK: XTX1.208(DDCK) ; port X3_DDCK
DDDA: XTX1.210(DDDA) ; port X3_DDDA
EXTSMI#: XTX1.321(EXTSMI#) ; port X4_EXTSMI#
GPE1#: XTX1.342(GPE1#) ; port X4_GPE1#
GPE2#: XTX1.389(GPE2#) ; port X4_GPE2#
IL_SATA: XTX1.158(IL_SATA#) ; port X2_IL_SATA#
OVCR#: XTX1.319(OVCR#) ; port X4_OVCR#
RSMRST#: XTX1.311(RSMRST#) ; port X4_RSMRST#
RX_N: XTX1.106(SATA0_RX-) ; port SATA.-RX
RX_P: XTX1.104(SATA0_RX+) ; port SATA.+RX
RXD_N: XTX1.391(RXD#) ; port X4_RXD#
RXD_P: XTX1.393(RXD) ; port X4_RXD
TX_N: XTX1.110(SATA0_TX-) ; port SATA.-TX
TX_P: XTX1.112(SATA0_TX+) ; port SATA.+TX
TXD_N: XTX1.395(TXD#) ; port X4_TXD#
TXD_P: XTX1.397(TXD) ; port X4_TXD
USB0_N: XTX1.76(USB0#) ; port USB0_N
USB0_P: XTX1.88(USB0) ; port USB0_P
USB1_N: XTX1.80(USB1#) ; port USB1_N
USB1_P: XTX1.92(USB1) ; port USB1_P
USB2_N: XTX1.58(USB2#) ; port USB2_N
USB2_P: XTX1.66(USB2) ; port USB2_P
USB3_N: XTX1.62(USB3#) ; port USB3_N
USB3_P: XTX1.72(USB3) ; port USB3_P
USB4_N: XTX1.147(USBP4#) ; port USB4_N
USB4_P: XTX1.145(USBP4) ; port USB4_P
USB5_N: XTX1.127(USBP5#) ; port USB5_N
USB5_P: XTX1.125(USBP5) ; port USB5_P
WDTRIG: XTX1.148(WDTRIG) ; port X2_WDTRIG
NetbtnReset_1: btnReset.1 R14.1 XTX1.304(PWGIN)
NetC12_1: XTX1.204(B) ; port X3_B
NetC13_1: XTX1.206(G) ; port X3_G
NetC14_1: XTX1.203(R) ; port X3_R
NetD2_2: XTX1.314(SPEEDLED#) ; port X4_SPEEDLED#
NetR6_1: XTX1.150(SATALED#) ; port X2_SATALED#
NetU1_13: XTX1.205(HSY) ; port X3_HSY
NetU1_15: XTX1.207(VSY) ; port X3_VSY
NetX1_10: XTX1.310(LILED#) ; port X4_LILED#
NetX1_12: XTX1.312(ACTLED#) ; port X4_ACTLED#

Not connected (* = marked no-connect by the designer): btnReset 2* 3*; XTX1 3(PCICLK3)* 4(PCICLK4)* 7(PCICLK1)* 8(PCICLK2)* 9(REQ3#)* 10(GNT3#)* 11(GNT2#)* 12(3V)* 13(REQ2#)* 14(GNT1#)* 15(REQ1#)* 16(3V)* 17(GNT0#)* 18(RESERVED)* 21(SERIRQ)* 22(REQ0#)* 23(AD0)* 24(3V)* 25(AD1)* 26(AD2)* 27(AD4)* 28(AD3)* 29(AD6)* 30(AD5)* 31(CBE0#)* 32(AD7)* 33(AD8)* 34(AD9)* 37(AD10)* 38(AUXAL)* 39(AD11)* 40(MIC)* 41(AD12)* 42(AUXAR)* 43(AD13)* 44(ASVCC)* 45(AD14)* 46(SNDL)* 47(AD15)* 48(ASGND)* 49(CBE1#)* 50(SNDR)* 53(PAR)* 54(SERR#)* 55(GPERR#)* 56(Reserved)* 57(PME#)* 59(LOCK#)* 60(DEVSEL#)* 61(TRDY#)* 63(IRDY#)* 64(STOP#)* 65(FRAME#)* 69(AD16)* 70(CBE2#)* 71(AD17)* 73(AD19)* 74(AD18)* 75(AD20)* 77(AD22)* 78(AD21)* 79(AD23)* 81(AD24)* 82(CBE3#)* 85(AD25)* 86(AD26)* 87(AD28)* 89(AD27)* 90(AD29)* 91(AD30)* 93(PCIRST#)* 94(AD31)* 95(INTC#)* 96(INTD#)* 97(INTA#)* 98(INTB#)* 103(PCIE_CLK_REF+)* 105(PCIE_CLK_REF-)* 109(PCIE3_TX+)* 111(PCIE3_TX-)* 114(5V_SB)* 115(PCIE3_RX+)* 116(SATA1_RX+)* 117(PCIE3_RX-)* 118(SATA1_RX-)* 120(5V_SB)* 121(EXC1_CPPE#)* 122(SATA1_TX-)* 123(EXC1_RST#)* 124(SATA1_TX+)* 128(SATA2_RX+)* 130(SATA2_RX-)* 131(PCIE2_TX+)* 132(SUS_STAT#)* 133(PCIE2_TX-)* 134(PCI_CLKRUN#)* 137(PCIE2_RX+)* 138(SATA2_TX-)* 139(PCIE2_RX-)* 140(SATA2_TX+)* 141(EXC0_CPPE#)* 143(EXC0_RST#)* 144(SATA3_RX+)* 146(SATA3_RX-)* 149(SLP_S3#)* 153(PCIE1_RX-)* 154(SATA3_TX-)* 155(PCIE1_RX+)* 156(SATA3_TX+)* 159(PCIE1_TX-)* 160(PP_TPM)* 161(PCIE1_TX+)* 162(RESERVED)* 163(PCE_WAKE#)* 164(PCI_GNT#A)* 165(SLP_S5#)* 166(PCI_REQ#A)* 169(PCIE0_RX-)* 170(RESERVED)* 171(PCIE0_RX+)* 172(RESERVED)* 175(PCIE0_TX-)* 176(RESERVED)* 177(PCIE0_TX+)* 178(RESERVED)* 179(CODECSET)* 181(AC_RST#)* 182(AC_SDOUT)* 185(AC_SYNC)* 186(AC_SDIN0)* 187(AC_SDIN1)* 188(AC_SDIN2)* 189(AC_BIT_CLK)* 190(FAN_TACHOIN)* 191(LPC_AD0)* 192(FAN_PWMOUT)* 193(LPC_AD1)* 194(LPC_FRAME#)* 195(LPC_AD2)* 196(LPC_DRQ0#)* 197(LPC_AD3)* 198(LPC_DRQ1#)* 209(DETECT#)* 211(LCDDO16)* 212(LCDDO18)* 213(LCDDO17)* 214(LCDDO19)* 217(LCDDO13)* 218(LCDDO15)* 219(LCDDO12)* 220(LCDDO14)* 223(LCDDO8)* 224(LCDDO11)* 225(LCDDO9)* 226(LCDDO10)* 229(LCDDO4)* 230(LCDDO7)* 231(LCDDO5)* 232(LCDDO6)* 235(LCDDO1)* 236(LCDDO3)* 237(LCDDO0)* 238(LCDDO2)* 241(FPDDC_DAT)* 242(LTGIO0)* 243(FPDDC_CLK)* 244(BLON#)* 245(BIASON)* 246(DIGON)* 247(COMP)* 248(Y)* 249(SYNC)* 250(C)* 251(LPT/FLP#)* 252(RESERVED)* 255(STB#/RESERVED)* 256(AFD#/DENSEL)* 257(RESERVED) 258(PD7/RESERVED)* 259(IRRX)* 260(ERR#/HDSEL#)* 261(IRTX)* 262(PD6/RESERVED)* 263(RXD2)* 264(INIT#/DIR#)* 267(RTS2#)* 268(PD5/RESERVED)* 269(DTR2#)* 270(SLIN#/STEP#)* 271(DCD2#)* 272(PD4/DSKCHG#)* 273(DSR2#)* 274(PD3/RDATA#)* 275(CTS2#)* 276(PD2/WP#)* 277(TXD2)* 278(PD1/TRK0#)* 279(RI2#)* 280(PD0/INDEX#)* 283(RXD1)* 284(ACK#/DRV)* 285(RTS1#)* 286(BUSY/MOT)* 287(DTR1#)* 288(PE/WDATA#)* 289(DCD1#)* 290(SLCT/WGATE#)* 291(DSR1#)* 292(MSCLK)* 293(CTS1#)* 294(MSDAT)* 295(TXD1)* 296(KBCLK)* 297(RI1#)* 298(KBDAT)* 303(5V_SB)* 305(PS_ON#)* 306(SPEAKER)* 307(PWRBTN#)* 309(KBINH#)* 313(ROMKBCS#)* 315(EXT_PRG)* 316(I2CLK)* 320(GPCS#)* 322(I2DAT)* 323(SMBCLK)* 324(SMBDATA)* 325(SIDE_CS3#)* 326(SMBALRT#)* 327(SIDE_CS1#)* 328(DASP_S)* 329(SIDE_A2)* 330(PIDE_CS3#)* 331(SIDE_A0)* 332(PIDE_CS1#)* 335(PDIAG_S)* 336(PIDE_A2)* 337(SIDE_A1)* 338(PIDE_A0)* 339(SIDE_INTRQ)* 340(PIDE_A1)* 341(BATLOW#) 343(SIDE_AK#)* 344(PIDE_INTRQ)* 345(SIDE_RDY)* 346(PIDE_AK#)* 347(SIDE_IOR#)* 348(PIDE_RDY)* 351(SIDE_IOW#)* 352(PIDE_IOR#)* 353(SIDE_DRQ)* 354(PIDE_IOW#)* 355(SIDE_D15)* 356(PIDE_DRQ) 357(SIDE_D0)* 358(PIDE_D15)* 359(SIDE_D14)* 360(PIDE_D0)* 361(SIDE_D1)* 362(PIDE_D14)* 363(SIDE_D13)* 364(PIDE_D1)* 367(SIDE_D2)* 368(PIDE_D13)* 369(SIDE_D12)* 370(PIDE_D2)* 371(SIDE_D3)* 372(PIDE_D12)* 373(SIDE_D11)* 374(PIDE_D3)* 375(SIDE_D4)* 376(PIDE_D11)* 377(SIDE_D10)* 378(PIDE_D4)* 379(SIDE_D5)* 380(PIDE_D10)* 383(SIDE_D9)* 384(PIDE_D5)* 385(SIDE_D6)* 386(PIDE_D9)* 387(SIDE_D8)* 388(PIDE_D6)* 390(CBLID_P#)* 392(PIDE_D8)* 394(SIDE_D7)* 396(PIDE_D7)* 398(HDRST#)*

### Layout directives
differential pair: RX_N, RX_P, RXD_N, RXD_P, TX_N, TX_P, TXD_N, TXD_P, USB0_N, USB0_P, USB1_N, USB1_P, USB2_N, USB2_P, USB3_N, USB3_P, USB4_N, USB4_P, USB5_N, USB5_P

### Notes on the sheet
- (in symbol XTX_Board, part A) X1
- (in symbol XTX_Board, part B) X2
- (in symbol XTX_Board, part C) X3
- (in symbol XTX_Board, part D) X4

### Library data of the parts
btnReset = FSM Switch: FSM 6mm Series Switch; Supplier Part #: 450-1650-ND; Supplier: DigiKey
R14 = Res3: Resistor; Published: 8-Jun-2000; LatestRevisionDate: 04-Mar-2005; LatestRevisionNote: PCB Footprint replaced.; PackageReference: J1-0603; Publisher: Altium Limited; Supplier Part #: P100KGCT-ND; Supplier: DigiKey
XTX1 = XTX_Board: Datasheet: http://www.xtx-standard.org/fileadmin/documents/XTX-Spec12.pdf

## Sheet Power.SchDoc
size A
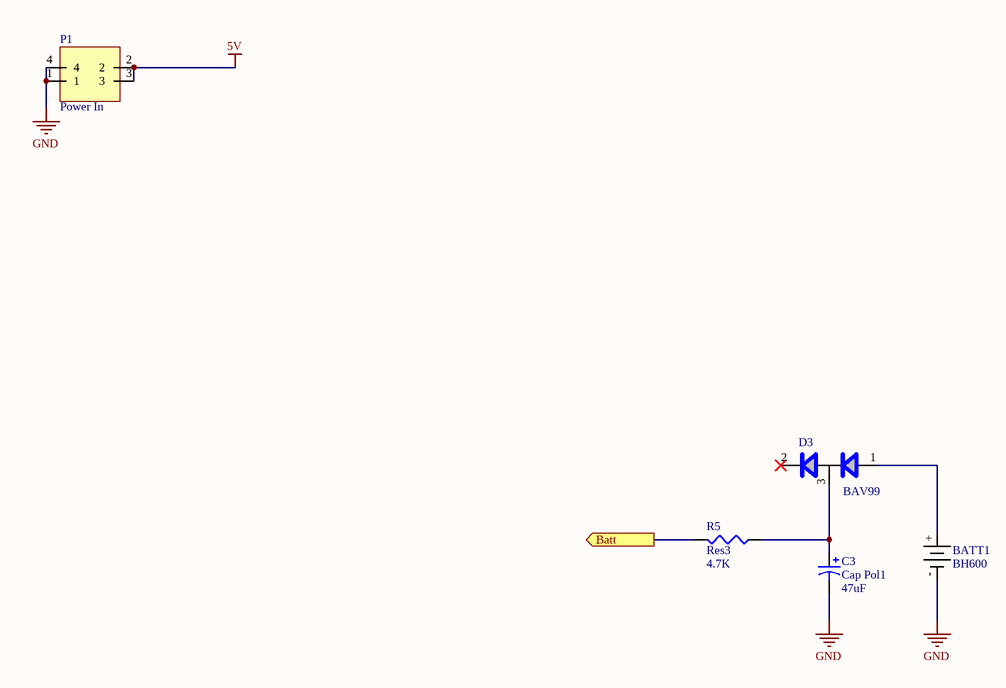
[diagram p6: Power.SchDoc]

### Parts
BATT1  BH600  [BH600]
C3  Cap Pol1  value 47uF  [CAPPR5-5x5]
D3  BAV99  [SOT23]
P1  Power In  [0039300040 MINI-FIT JR 4-Pos Right Angle]
R5  Res3  value 4.7K  [J1-0603]

### Ports
Batt (out)

### Nets
5V: P1.2 P1.3
GND: BATT1.- C3.2 P1.1 P1.4
Batt: R5.2 ; port Batt
NetBATT1_+: BATT1.+ D3.1
NetC3_1: C3.1 D3.3 R5.1

Not connected (* = marked no-connect by the designer): D3 2*

### Library data of the parts
BATT1 = BH600: 16mm Battery Holder - Memory Protection Devices; Supplier Part #: BH600-ND; Supplier: DigiKey
C3 = Cap Pol1: Polarized Capacitor (Radial); Published: 8-Jun-2000; LatestRevisionDate: 17-Jul-2002; LatestRevisionNote: Re-released for DXP Platform.; PackageReference: RB7.6-15; Publisher: Altium Limited; Supplier Part #: P5137-ND; Supplier: DigiKey
D3 = BAV99: Dual Surface Mount Switching Diode; Model: BAV99-7-F; Supplier Part #: BAV99-FDICT-ND; Supplier: DigiKey
P1 = 0039300040 Mini-Fit 2x2 Right Angle: Supplier Part #: WM21352-ND; Supplier: DigiKey
R5 = Res3: Resistor; Published: 8-Jun-2000; LatestRevisionDate: 04-Mar-2005; LatestRevisionNote: PCB Footprint replaced.; PackageReference: J1-0603; Publisher: Altium Limited; Supplier Part #: P4.7KGCT-ND; Supplier: DigiKey

## Nets that join several sheets
5V: Carrier_Board (OR1.5 P2.11 PWR_LED.1), U_USB1 (7 pins), U_USB2 (7 pins), U_USB3 (7 pins), Ethernet (R2.1 R3.1 R4.1), SATA (D4.1 SATA1.P7 SATA1.P8 SATA1.P9), VGA (10 pins), XTX (25 pins), Power (P1.2 P1.3)
GND: Carrier_Board (8 pins), U_USB1 (13 pins), U_USB2 (13 pins), U_USB3 (13 pins), Ethernet (C1.2 C2.2 X1.4 X1.5), SATA (9 pins), VGA (29 pins), XTX (50 pins), Power (BATT1.- C3.2 P1.1 P1.4)
Batt: XTX (XTX1.308), Power (R5.2)
DDCK: VGA (U1.11), XTX (XTX1.208)
DDDA: VGA (U1.10), XTX (XTX1.210)
EXTSMI#: Carrier_Board (P2.3), XTX (XTX1.321)
GPE1#: Carrier_Board (P2.5), XTX (XTX1.342)
GPE2#: Carrier_Board (P2.7), XTX (XTX1.389)
NetC8_1_2: Carrier_Board (J1.1), U_USB1 (C8_1.2 FB1_1.2)
NetC8_2_2: Carrier_Board (J3.1), U_USB2 (C8_2.2 FB1_2.2)
NetC8_3_2: Carrier_Board (J5.1), U_USB3 (C8_3.2 FB1_3.2)
NetC9_1_2: Carrier_Board (J1.5), U_USB1 (C9_1.2 FB2_1.2)
NetC9_2_2: Carrier_Board (J3.5), U_USB2 (C9_2.2 FB2_2.2)
NetC9_3_2: Carrier_Board (J5.5), U_USB3 (C9_3.2 FB2_3.2)
NetC10_1_2: Carrier_Board (J2.1), U_USB1 (C10_1.2 FB3_1.2)
NetC10_2_2: Carrier_Board (J4.1), U_USB2 (C10_2.2 FB3_2.2)
NetC10_3_2: Carrier_Board (J6.1), U_USB3 (C10_3.2 FB3_3.2)
NetC11_1_2: Carrier_Board (J2.5), U_USB1 (C11_1.2 FB4_1.2)
NetC11_2_2: Carrier_Board (J4.5), U_USB2 (C11_2.2 FB4_2.2)
NetC11_3_2: Carrier_Board (J6.5), U_USB3 (C11_3.2 FB4_3.2)
NetC12_1: VGA (C12.1 FB7.1 R7.1), XTX (XTX1.204)
NetC13_1: VGA (C13.1 FB6.1 R8.1), XTX (XTX1.206)
NetC14_1: VGA (C14.1 FB5.1 R9.1), XTX (XTX1.203)
NetD2_2: Ethernet (D2.2), XTX (XTX1.314)
NetIC1_1_2: Carrier_Board (OR1.1), U_USB1 (IC1_1.2 IC1_1.3)
NetIC1_2_2: Carrier_Board (OR1.3), U_USB2 (IC1_2.2 IC1_2.3)
NetIC1_3_2: Carrier_Board (OR1.6), U_USB3 (IC1_3.2 IC1_3.3)
NetR6_1: SATA (R6.1), XTX (XTX1.150)
NetU1_13: VGA (U1.13), XTX (XTX1.205)
NetU1_15: VGA (U1.15), XTX (XTX1.207)
NetX1_10: Ethernet (X1.10), XTX (XTX1.310)
NetX1_12: Ethernet (X1.12), XTX (XTX1.312)
OVCR#: Carrier_Board (OR1.4), XTX (XTX1.319)
RSMRST#: Carrier_Board (P2.1), XTX (XTX1.311)
RX_N: SATA (SATA1.S5), XTX (XTX1.106)
RX_P: SATA (SATA1.S6), XTX (XTX1.104)
RXD_N: Ethernet (X1.8), XTX (XTX1.391)
RXD_P: Ethernet (X1.7), XTX (XTX1.393)
TX_N: SATA (SATA1.S3), XTX (XTX1.110)
TX_P: SATA (SATA1.S2), XTX (XTX1.112)
TXD_N: Ethernet (X1.2), XTX (XTX1.395)
TXD_P: Ethernet (X1.1), XTX (XTX1.397)
USB0_N: Carrier_Board (J1.2), U_USB1 (TVS1_1.2), XTX (XTX1.76)
USB0_P: Carrier_Board (J1.3), U_USB1 (TVS1_1.3), XTX (XTX1.88)
USB1_N: Carrier_Board (J2.2), U_USB1 (TVS2_1.3), XTX (XTX1.80)
USB1_P: Carrier_Board (J2.3), U_USB1 (TVS2_1.2), XTX (XTX1.92)
USB2_N: Carrier_Board (J3.2), U_USB2 (TVS1_2.2), XTX (XTX1.58)
USB2_P: Carrier_Board (J3.3), U_USB2 (TVS1_2.3), XTX (XTX1.66)
USB3_N: Carrier_Board (J4.2), U_USB2 (TVS2_2.3), XTX (XTX1.62)
USB3_P: Carrier_Board (J4.3), U_USB2 (TVS2_2.2), XTX (XTX1.72)
USB4_N: Carrier_Board (J5.2), U_USB3 (TVS1_3.2), XTX (XTX1.147)
USB4_P: Carrier_Board (J5.3), U_USB3 (TVS1_3.3), XTX (XTX1.145)
USB5_N: Carrier_Board (J6.2), U_USB3 (TVS2_3.3), XTX (XTX1.127)
USB5_P: Carrier_Board (J6.3), U_USB3 (TVS2_3.2), XTX (XTX1.125)
WDTRIG: Carrier_Board (P2.9), XTX (XTX1.148)